# Altium project FIT_PM12_v1.1.PrjPcb (part 13 of 13)
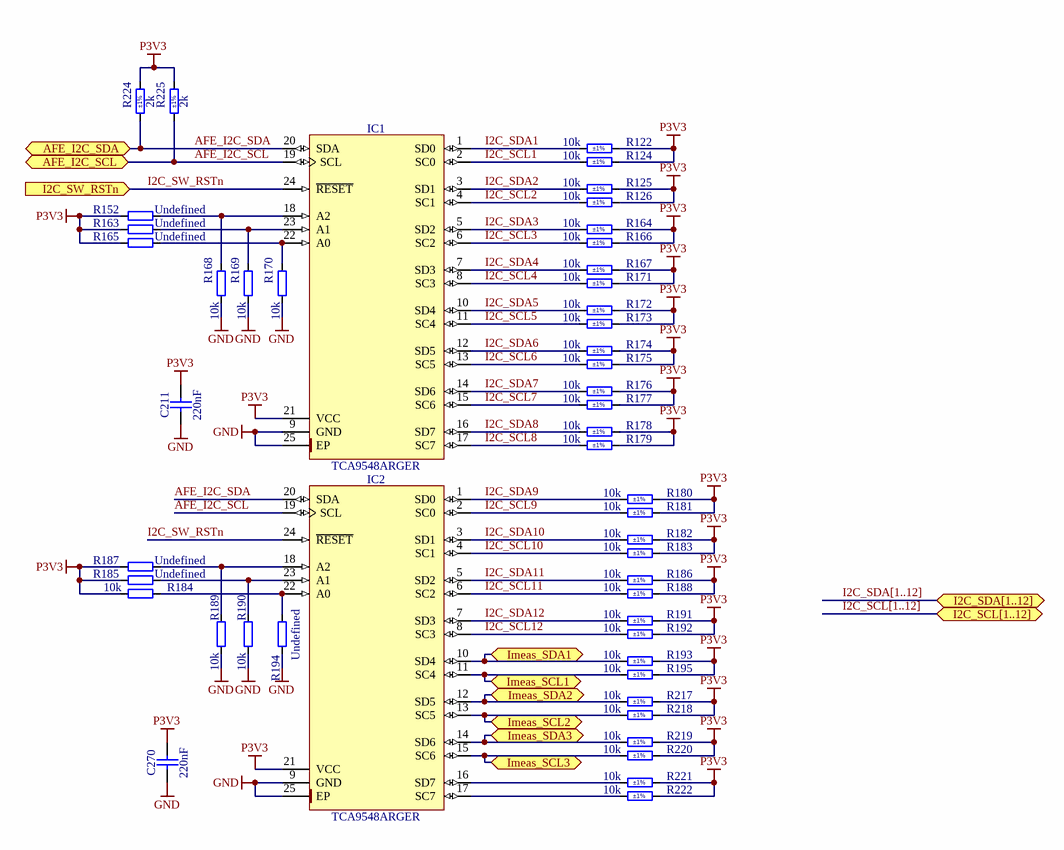
[diagram p36: I2C_Switch.SchDoc]

## Nets that join several sheets (continued)
PLL_LOCK: Main_PLL (DD3.37), PM12_ATxmega128 (DD5.54), PM12_Supply_LED (DD13.9 DD13.10)
PLL_SPI_CLK: Main_PLL (DD3.24), PM12_ATxmega128 (DD5.23), FPGA_C (DD6.F22), AFE (DD31.2)
PLL_SPI_LE: Main_PLL (DD3.25), PM12_ATxmega128 (DD5.50)
PLL_SPI_MISO: Main_PLL (DD3.22), PM12_ATxmega128 (DD5.22), FPGA_C (DD6.G24)
PLL_SPI_MOSI: Main_PLL (DD3.23), PM12_ATxmega128 (DD5.21), FPGA_C (DD6.G25), AFE/QDC1 (DA22A.11), AFE/QDC2 (DA22B.11), AFE/QDC3 (DA22C.11), AFE/QDC4 (DA22D.11), AFE/QDC5 (DA22E.11), AFE/QDC6 (DA22F.11), AFE/QDC7 (DA22G.11), AFE/QDC8 (DA22H.11), AFE/QDC9 (DA22I.11), AFE/QDC10 (DA22J.11), AFE/QDC11 (DA22K.11), AFE/QDC12 (DA22L.11)
PLL_SYNC: Main_PLL (DD3.14), PM12_ATxmega128 (DD5.51)
RDA1_N: FPGA_H (DD6.Y5), THS788_1 (DD4.79)
RDA1_P: FPGA_H (DD6.Y6), THS788_1 (DD4.78)
RDA2_N: FPGA_G (DD6.AF7), THS788_2 (DD24.79)
RDA2_P: FPGA_G (DD6.AE7), THS788_2 (DD24.78)
RDA3_N: FPGA_D_F (DD6.AD14), THS788_3 (DD25.79)
RDA3_P: FPGA_D_F (DD6.AC14), THS788_3 (DD25.78)
RDB1_N: FPGA_H (DD6.AB5), THS788_1 (DD4.48)
RDB1_P: FPGA_H (DD6.AA5), THS788_1 (DD4.49)
RDB2_N: FPGA_G (DD6.AF8), THS788_2 (DD24.48)
RDB2_P: FPGA_G (DD6.AE8), THS788_2 (DD24.49)
RDB3_N: FPGA_D_F (DD6.Y16), THS788_3 (DD25.48)
RDB3_P: FPGA_D_F (DD6.Y15), THS788_3 (DD25.49)
RDC1_N: FPGA_H (DD6.AE2), THS788_1 (DD4.97)
RDC1_P: FPGA_H (DD6.AE3), THS788_1 (DD4.98)
RDC2_N: FPGA_G (DD6.W11), THS788_2 (DD24.97)
RDC2_P: FPGA_G (DD6.V11), THS788_2 (DD24.98)
RDC3_N: FPGA_D_F (DD6.AD18), THS788_3 (DD25.97)
RDC3_P: FPGA_D_F (DD6.AC18), THS788_3 (DD25.98)
RDD1_N: FPGA_H (DD6.AC3), THS788_1 (DD4.28)
RDD1_P: FPGA_H (DD6.AC4), THS788_1 (DD4.27)
RDD2_N: FPGA_G (DD6.AB10), THS788_2 (DD24.28)
RDD2_P: FPGA_G (DD6.AA10), THS788_2 (DD24.27)
RDD3_N: FPGA_D_F (DD6.V17), THS788_3 (DD25.28)
RDD3_P: FPGA_D_F (DD6.V16), THS788_3 (DD25.27)
RSA1_N: FPGA_H (DD6.W3), THS788_1 (DD4.81)
RSA1_P: FPGA_H (DD6.V3), THS788_1 (DD4.80)
RSA2_N: FPGA_G (DD6.AC7), THS788_2 (DD24.81)
RSA2_P: FPGA_G (DD6.AB7), THS788_2 (DD24.80)
RSA3_N: FPGA_D_F (DD6.AB15), THS788_3 (DD25.81)
RSA3_P: FPGA_D_F (DD6.AB14), THS788_3 (DD25.80)
RSB1_N: FPGA_H (DD6.AB4), THS788_1 (DD4.46)
RSB1_P: FPGA_H (DD6.AA4), THS788_1 (DD4.47)
RSB2_N: FPGA_G (DD6.W9), THS788_2 (DD24.46)
RSB2_P: FPGA_G (DD6.W10), THS788_2 (DD24.47)
RSB3_N: FPGA_D_F (DD6.AE15), THS788_3 (DD25.46)
RSB3_P: FPGA_D_F (DD6.AD15), THS788_3 (DD25.47)
RSC1_N: FPGA_H (DD6.AF2), THS788_1 (DD4.95)
RSC1_P: FPGA_H (DD6.AF3), THS788_1 (DD4.96)
RSC2_N: FPGA_G (DD6.AC11), THS788_2 (DD24.95)
RSC2_P: FPGA_G (DD6.AB11), THS788_2 (DD24.96)
RSC3_N: FPGA_D_F (DD6.AF17), THS788_3 (DD25.95)
RSC3_P: FPGA_D_F (DD6.AE17), THS788_3 (DD25.96)
RSD1_N: FPGA_H (DD6.AC1), THS788_1 (DD4.30)
RSD1_P: FPGA_H (DD6.AB1), THS788_1 (DD4.29)
RSD2_N: FPGA_G (DD6.Y10), THS788_2 (DD24.30)
RSD2_P: FPGA_G (DD6.Y11), THS788_2 (DD24.29)
RSD3_N: FPGA_D_F (DD6.AE16), THS788_3 (DD25.30)
RSD3_P: FPGA_D_F (DD6.AD16), THS788_3 (DD25.29)
RST: PM12_ATxmega128 (DD5.13), FPGA_C (DD6.H26)
SPI_SCLK_BUF: AFE (R163#1.2), AFE/QDC1 (DA22A.10), AFE/QDC2 (DA22B.10), AFE/QDC3 (DA22C.10), AFE/QDC4 (DA22D.10), AFE/QDC5 (DA22E.10), AFE/QDC6 (DA22F.10), AFE/QDC7 (DA22G.10), AFE/QDC8 (DA22H.10), AFE/QDC9 (DA22I.10), AFE/QDC10 (DA22J.10), AFE/QDC11 (DA22K.10), AFE/QDC12 (DA22L.10)
STR1_: FPGA_H (DD6.W5), AFE/CPLD1 (DD18A.82)
STR1_: FPGA_D_F (DD6.J19), AFE/CPLD12 (DD18L.82)
STR1_: FPGA_D_F (DD6.AA15), AFE/CPLD3 (DD18C.82)
STR1_: FPGA_D_F (DD6.AD20), AFE/CPLD4 (DD18D.82)
STR1_: FPGA_A_B (DD6.W26), AFE/CPLD7 (DD18G.82)
STR1_: FPGA_A_B (DD6.AA23), AFE/CPLD6 (DD18F.82)
STR1_: FPGA_A_B (DD6.AB21), AFE/CPLD5 (DD18E.82)
STR1_: FPGA_A_B (DD6.M26), AFE/CPLD11 (DD18K.82)
STR1_: FPGA_A_B (DD6.R22), AFE/CPLD9 (DD18I.82)
STR1_: FPGA_A_B (DD6.U20), AFE/CPLD8 (DD18H.82)
STR1_: FPGA_A_B (DD6.N17), AFE/CPLD10 (DD18J.82)
STR1_: FPGA_G (DD6.AA7), AFE/CPLD2 (DD18B.82)
TCM_CLK_N: Main_PLL (DD3.46), PM12_CONN (X9.19)
TCM_CLK_P: Main_PLL (DD3.45), PM12_CONN (X9.14)
TDC_CLK_1_N: ADCLK (DD26.8), THS788_1 (DD4.20 R32.1)
TDC_CLK_1_P: ADCLK (DD26.9), THS788_1 (DD4.19 R32.2)
TDC_CLK_2_N: ADCLK (DD26.20), THS788_2 (DD24.20 R52.1)
TDC_CLK_2_P: ADCLK (DD26.21), THS788_2 (DD24.19 R52.2)
TDC_CLK_3_N: ADCLK (DD26.23), THS788_3 (DD25.20 R14.1)
TDC_CLK_3_P: ADCLK (DD26.24), THS788_3 (DD25.19 R14.2)
TDC_CLK_N: Main_PLL (DD3.20), ADCLK (DD26.2 R152#1.1)
TDC_CLK_P: Main_PLL (DD3.19), ADCLK (DD26.3 R152#1.2)
TDC_SYNC_N: Main_PLL (DD3.17), ADCLK (DD27.2 R153.1)
TDC_SYNC_P: Main_PLL (DD3.16), ADCLK (DD27.3 R153.2)
TDCCLK1_N: FPGA_H (DD6.AC2), THS788_1 (DD4.44)
TDCCLK1_P: FPGA_H (DD6.AB2), THS788_1 (DD4.45)
TDCCLK2_N: FPGA_G (DD6.AD9), THS788_2 (DD24.44)
TDCCLK2_P: FPGA_G (DD6.AC9), THS788_2 (DD24.45)
TDCCLK3_N: FPGA_D_F (DD6.AC17), THS788_3 (DD25.44)
TDCCLK3_P: FPGA_D_F (DD6.AB17), THS788_3 (DD25.45)
THS788_OT_ALARM: PM12_ATxmega128 (DD5.12 R137.1), THS788_1 (DD4.53), THS788_3 (DD25.53), THS788_2 (DD24.53)
THS788_RESET: PM12_ATxmega128 (DD5.11), THS788_1 (DD4.51), THS788_3 (DD25.51), THS788_2 (DD24.51)
VREF_1.024V: AFE/INT1 (R300A.2), AFE/QDC1 (DA1A.3 DA1A.5 R42A.1 R44A.2)
VREF_1.024V: AFE/INT2 (R300B.2), AFE/QDC2 (DA1B.3 DA1B.5 R42B.1 R44B.2)
VREF_1.024V: AFE/INT3 (R300C.2), AFE/QDC3 (DA1C.3 DA1C.5 R42C.1 R44C.2)
VREF_1.024V: AFE/INT4 (R300D.2), AFE/QDC4 (DA1D.3 DA1D.5 R42D.1 R44D.2)
VREF_1.024V: AFE/INT5 (R300E.2), AFE/QDC5 (DA1E.3 DA1E.5 R42E.1 R44E.2)
VREF_1.024V: AFE/INT6 (R300F.2), AFE/QDC6 (DA1F.3 DA1F.5 R42F.1 R44F.2)
VREF_1.024V: AFE/INT7 (R300G.2), AFE/QDC7 (DA1G.3 DA1G.5 R42G.1 R44G.2)
VREF_1.024V: AFE/INT8 (R300H.2), AFE/QDC8 (DA1H.3 DA1H.5 R42H.1 R44H.2)
VREF_1.024V: AFE/INT9 (R300I.2), AFE/QDC9 (DA1I.3 DA1I.5 R42I.1 R44I.2)
VREF_1.024V: AFE/INT10 (R300J.2), AFE/QDC10 (DA1J.3 DA1J.5 R42J.1 R44J.2)
VREF_1.024V: AFE/INT11 (R300K.2), AFE/QDC11 (DA1K.3 DA1K.5 R42K.1 R44K.2)
VREF_1.024V: AFE/INT12 (R300L.2), AFE/QDC12 (DA1L.3 DA1L.5 R42L.1 R44L.2)
VREF_2.048V: AFE/INT1 (R400A.2), AFE/QDC1 (C64A.1 DA17A.6 DA22A.3 R39A.1)
VREF_2.048V: AFE/INT2 (R400B.2), AFE/QDC2 (C64B.1 DA17B.6 DA22B.3 R39B.1)
VREF_2.048V: AFE/INT3 (R400C.2), AFE/QDC3 (C64C.1 DA17C.6 DA22C.3 R39C.1)
VREF_2.048V: AFE/INT4 (R400D.2), AFE/QDC4 (C64D.1 DA17D.6 DA22D.3 R39D.1)
VREF_2.048V: AFE/INT5 (R400E.2), AFE/QDC5 (C64E.1 DA17E.6 DA22E.3 R39E.1)
VREF_2.048V: AFE/INT6 (R400F.2), AFE/QDC6 (C64F.1 DA17F.6 DA22F.3 R39F.1)
VREF_2.048V: AFE/INT7 (R400G.2), AFE/QDC7 (C64G.1 DA17G.6 DA22G.3 R39G.1)
VREF_2.048V: AFE/INT8 (R400H.2), AFE/QDC8 (C64H.1 DA17H.6 DA22H.3 R39H.1)
VREF_2.048V: AFE/INT9 (R400I.2), AFE/QDC9 (C64I.1 DA17I.6 DA22I.3 R39I.1)
VREF_2.048V: AFE/INT10 (R400J.2), AFE/QDC10 (C64J.1 DA17J.6 DA22J.3 R39J.1)
VREF_2.048V: AFE/INT11 (R400K.2), AFE/QDC11 (C64K.1 DA17K.6 DA22K.3 R39K.1)
VREF_2.048V: AFE/INT12 (R400L.2), AFE/QDC12 (C64L.1 DA17L.6 DA22L.3 R39L.1)